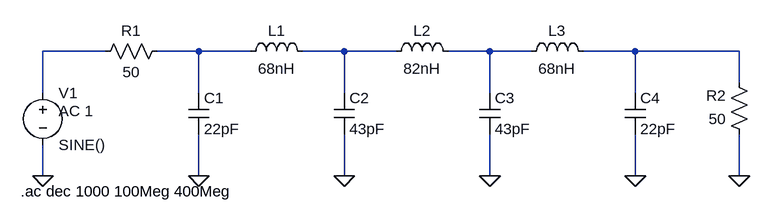
[diagram p0: schematic LC-LP-IN.asc]
LC-LP-IN.asc, the LTspice schematic file:
Version 4
SHEET 1 1828 1816
WIRE -1920 -1024 -2016 -1024
WIRE -1776 -1024 -1840 -1024
WIRE -1696 -1024 -1776 -1024
WIRE -1552 -1024 -1616 -1024
WIRE -1472 -1024 -1552 -1024
WIRE -1328 -1024 -1392 -1024
WIRE -1264 -1024 -1328 -1024
WIRE -1104 -1024 -1184 -1024
WIRE -944 -1024 -1104 -1024
WIRE -944 -976 -944 -1024
WIRE -2016 -960 -2016 -1024
WIRE -1776 -960 -1776 -1024
WIRE -1552 -960 -1552 -1024
WIRE -1328 -960 -1328 -1024
WIRE -1104 -960 -1104 -1024
WIRE -2016 -832 -2016 -880
WIRE -1776 -832 -1776 -896
WIRE -1552 -832 -1552 -896
WIRE -1328 -832 -1328 -896
WIRE -1104 -832 -1104 -896
WIRE -944 -832 -944 -896
FLAG -2016 -832 0
FLAG -1776 -832 0
FLAG -1552 -832 0
FLAG -1328 -832 0
FLAG -1104 -832 0
FLAG -944 -832 0
SYMBOL voltage -2016 -976 R0
WINDOW 123 24 44 Left 2
WINDOW 39 0 0 Left 0
SYMATTR InstName V1
SYMATTR Value SINE()
SYMATTR Value2 AC 1
SYMBOL res -1824 -1040 R90
WINDOW 0 0 56 VBottom 2
WINDOW 3 32 56 VTop 2
SYMATTR InstName R1
SYMATTR Value 50
SYMBOL res -928 -880 R180
WINDOW 0 36 76 Left 2
WINDOW 3 36 40 Left 2
SYMATTR InstName R2
SYMATTR Value 50
SYMBOL cap -1792 -960 R0
SYMATTR InstName C1
SYMATTR Value 22pF
SYMBOL cap -1568 -960 R0
SYMATTR InstName C2
SYMATTR Value 43pF
SYMBOL cap -1344 -960 R0
SYMATTR InstName C3
SYMATTR Value 43pF
SYMBOL cap -1120 -960 R0
SYMATTR InstName C4
SYMATTR Value 22pF
SYMBOL ind -1712 -1008 R270
WINDOW 0 32 56 VTop 2
WINDOW 3 5 56 VBottom 2
SYMATTR InstName L1
SYMATTR Value 68nH
SYMBOL ind -1488 -1008 R270
WINDOW 0 32 56 VTop 2
WINDOW 3 5 56 VBottom 2
SYMATTR InstName L2
SYMATTR Value 82nH
SYMBOL ind -1280 -1008 R270
WINDOW 0 32 56 VTop 2
WINDOW 3 5 56 VBottom 2
SYMATTR InstName L3
SYMATTR Value 68nH
TEXT -2050 -808 Left 2 !.ac dec 1000 100Meg 400Meg

The netlist it stands for:
* LC-LP-IN.asc
V1 N001 0 SINE() AC 1
R1 N002 N001 50
R2 0 N005 50
C1 N002 0 22pF
C2 N003 0 43pF
C3 N004 0 43pF
C4 N005 0 22pF
L1 N002 N003 68nH
L2 N003 N004 82nH
L3 N004 N005 68nH
.ac dec 1000 100Meg 400Meg
.backanno
.end